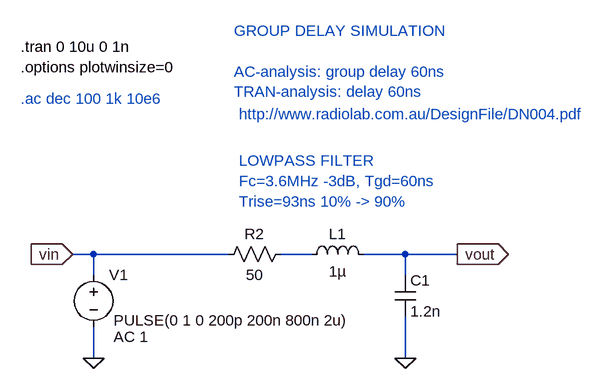
[diagram p0: schematic group_delay_lp.asc]
group_delay_lp.asc, the LTspice schematic file:
Version 4
SHEET 1 2244 852
WIRE -160 80 -192 80
WIRE 48 80 -160 80
WIRE 176 80 128 80
WIRE 320 80 256 80
WIRE 400 80 320 80
WIRE -160 112 -160 80
WIRE 320 112 320 80
WIRE -160 240 -160 192
WIRE 320 240 320 176
FLAG -160 240 0
FLAG -192 80 vin
IOPIN -192 80 In
FLAG 400 80 vout
IOPIN 400 80 Out
FLAG 320 240 0
SYMBOL cap 304 112 R0
SYMATTR InstName C1
SYMATTR Value 1.2n
SYMBOL voltage -160 96 R0
WINDOW 3 31 86 Left 0
WINDOW 123 31 111 Left 0
WINDOW 39 0 0 Left 0
SYMATTR Value PULSE(0 1 0 200p 200n 800n 2u)
SYMATTR Value2 AC 1
SYMATTR InstName V1
SYMBOL res 32 96 R270
WINDOW 0 32 56 VTop 0
WINDOW 3 0 56 VBottom 0
SYMATTR InstName R2
SYMATTR Value 50
SYMBOL ind 160 96 R270
WINDOW 0 32 56 VTop 0
WINDOW 3 5 56 VBottom 0
SYMATTR InstName L1
SYMATTR Value 1µ
TEXT -272 -160 Left 0 ;.ac dec 100 1k 10e6
TEXT -272 -240 Left 0 !.tran 0 10u 0 1n
TEXT -272 -208 Left 0 !.options plotwinsize=0
TEXT 56 -264 Left 0 ;GROUP DELAY SIMULATION\n \nAC-analysis: group delay 60ns\nTRAN-analysis: delay 60ns
TEXT 64 -64 Left 0 ;LOWPASS FILTER \nFc=3.6MHz -3dB, Tgd=60ns\nTrise=93ns 10% -> 90%
TEXT 64 -136 Left 0 ;http://www.radiolab.com.au/DesignFile/DN004.pdf

The netlist it stands for:
* group_delay_lp.asc
C1 vout 0 1.2n
V1 vin 0 PULSE(0 1 0 200p 200n 800n 2u) AC 1
R2 vin N001 50
L1 N001 vout 1µ
* .ac dec 100 1k 10e6
.tran 0 10u 0 1n
.options plotwinsize=0
* GROUP DELAY SIMULATION
* AC-analysis: group delay 60ns
* TRAN-analysis: delay 60ns
* LOWPASS FILTER
* Fc=3.6MHz -3dB, Tgd=60ns
* Trise=93ns 10% -> 90%
* http://www.radiolab.com.au/DesignFile/DN004.pdf
.backanno
.end